# EAGLE design ESO_SENIOR_DESIGN (EAGLE 9.1.3)

## Sheet 1 of 2
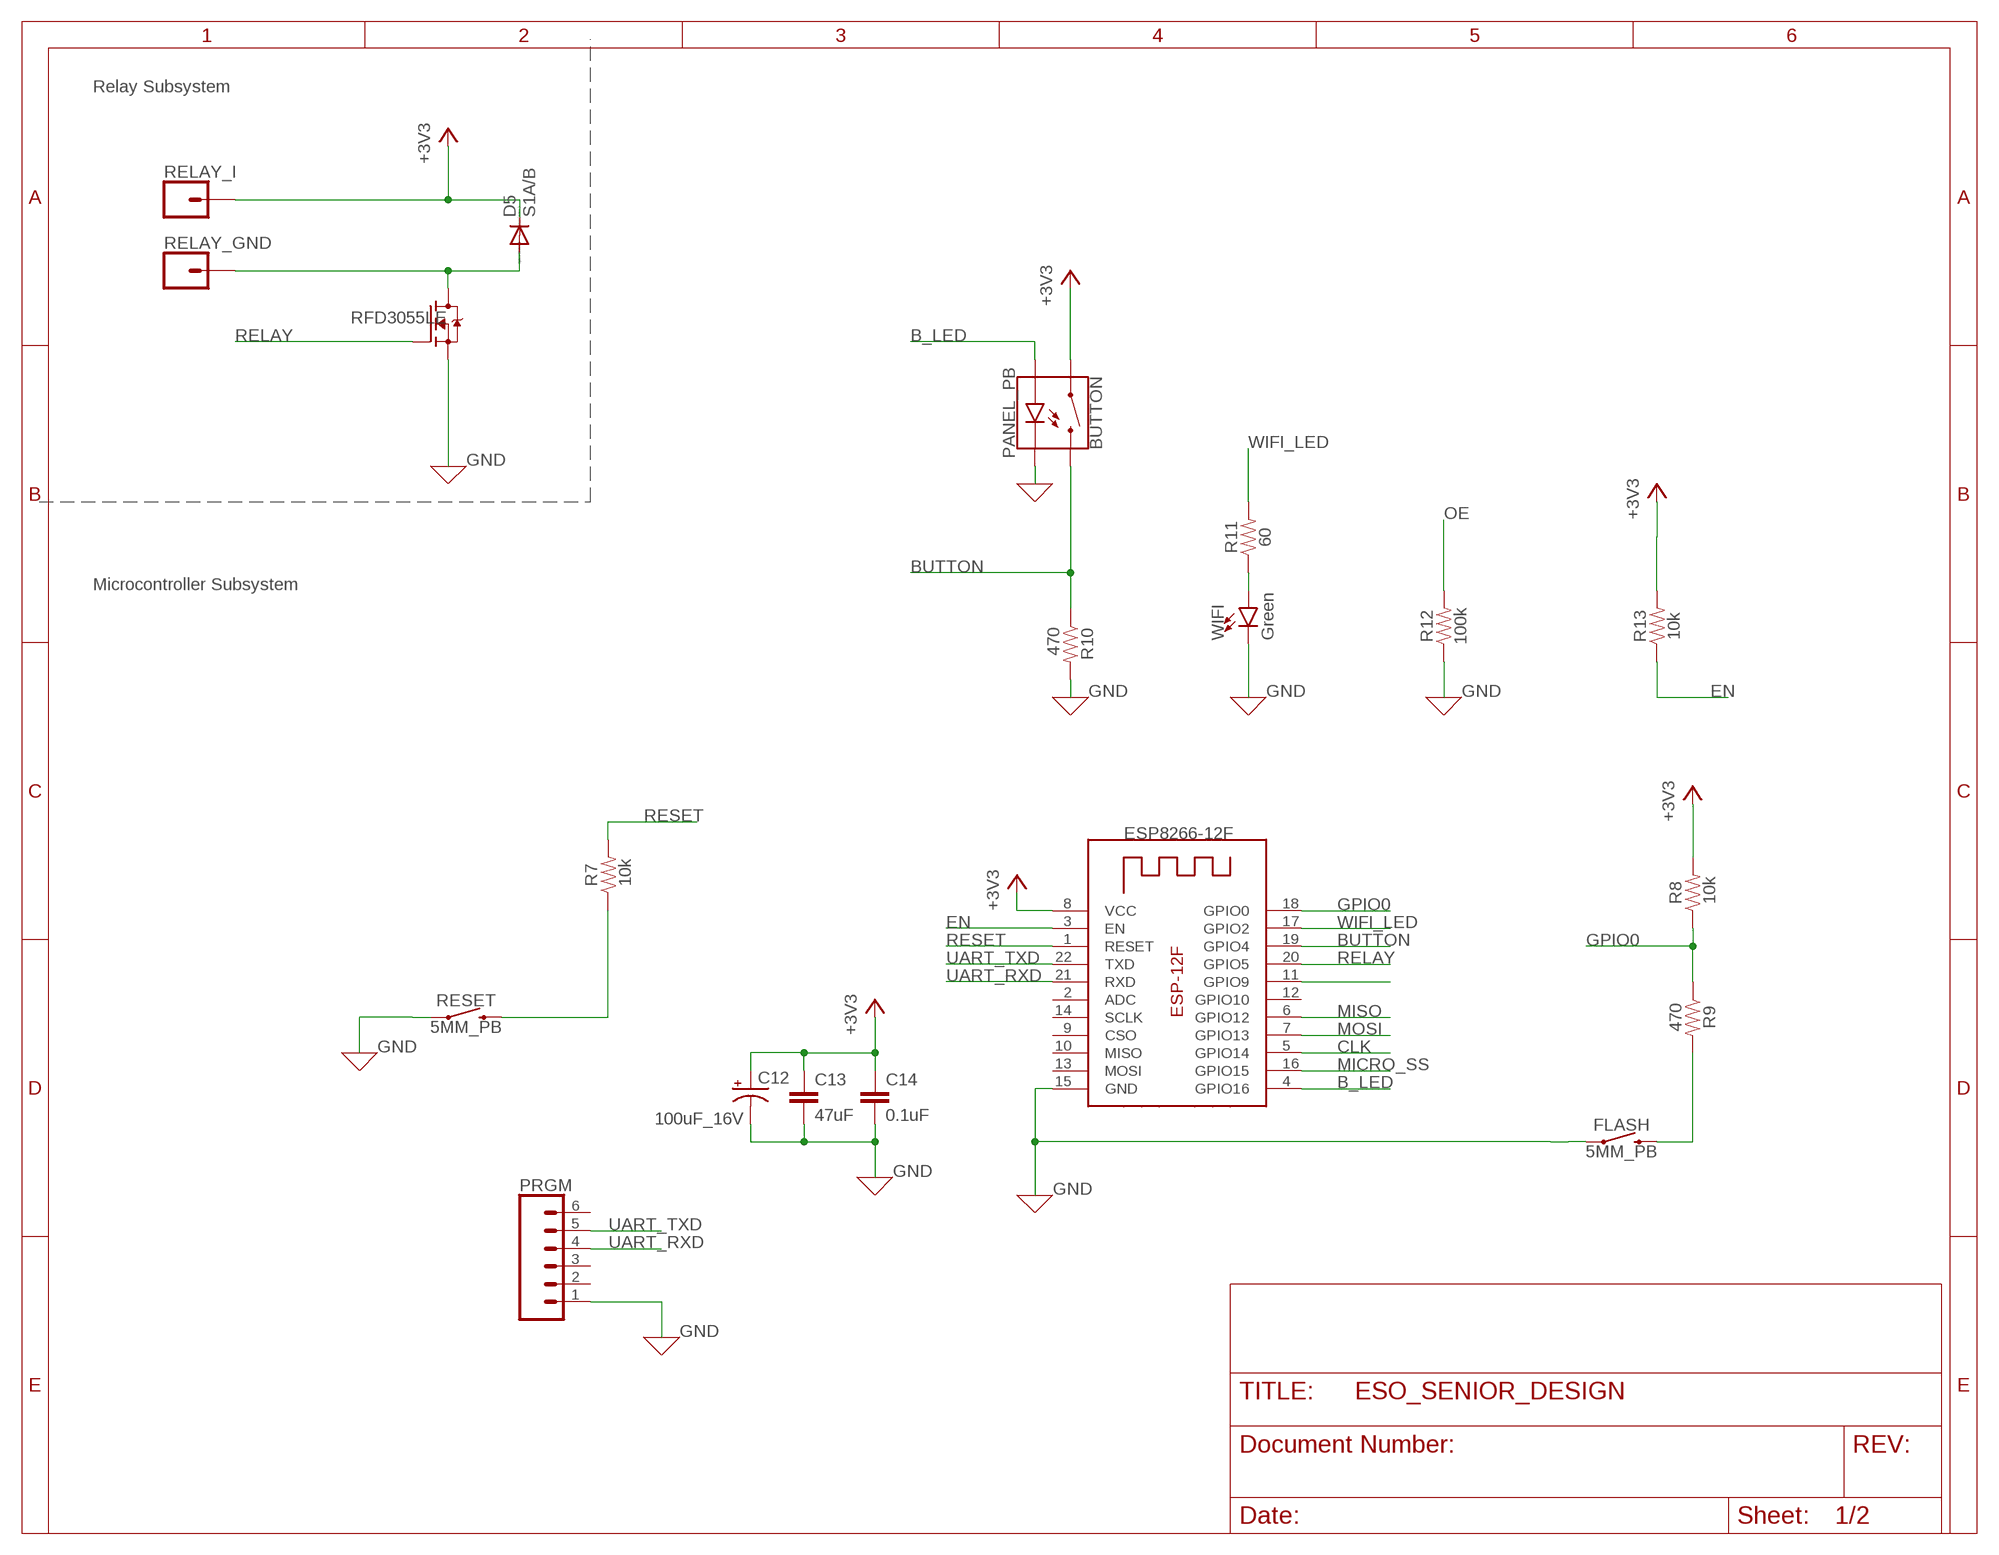
[diagram p0: schematic, sheet 1, part 1 of 2]
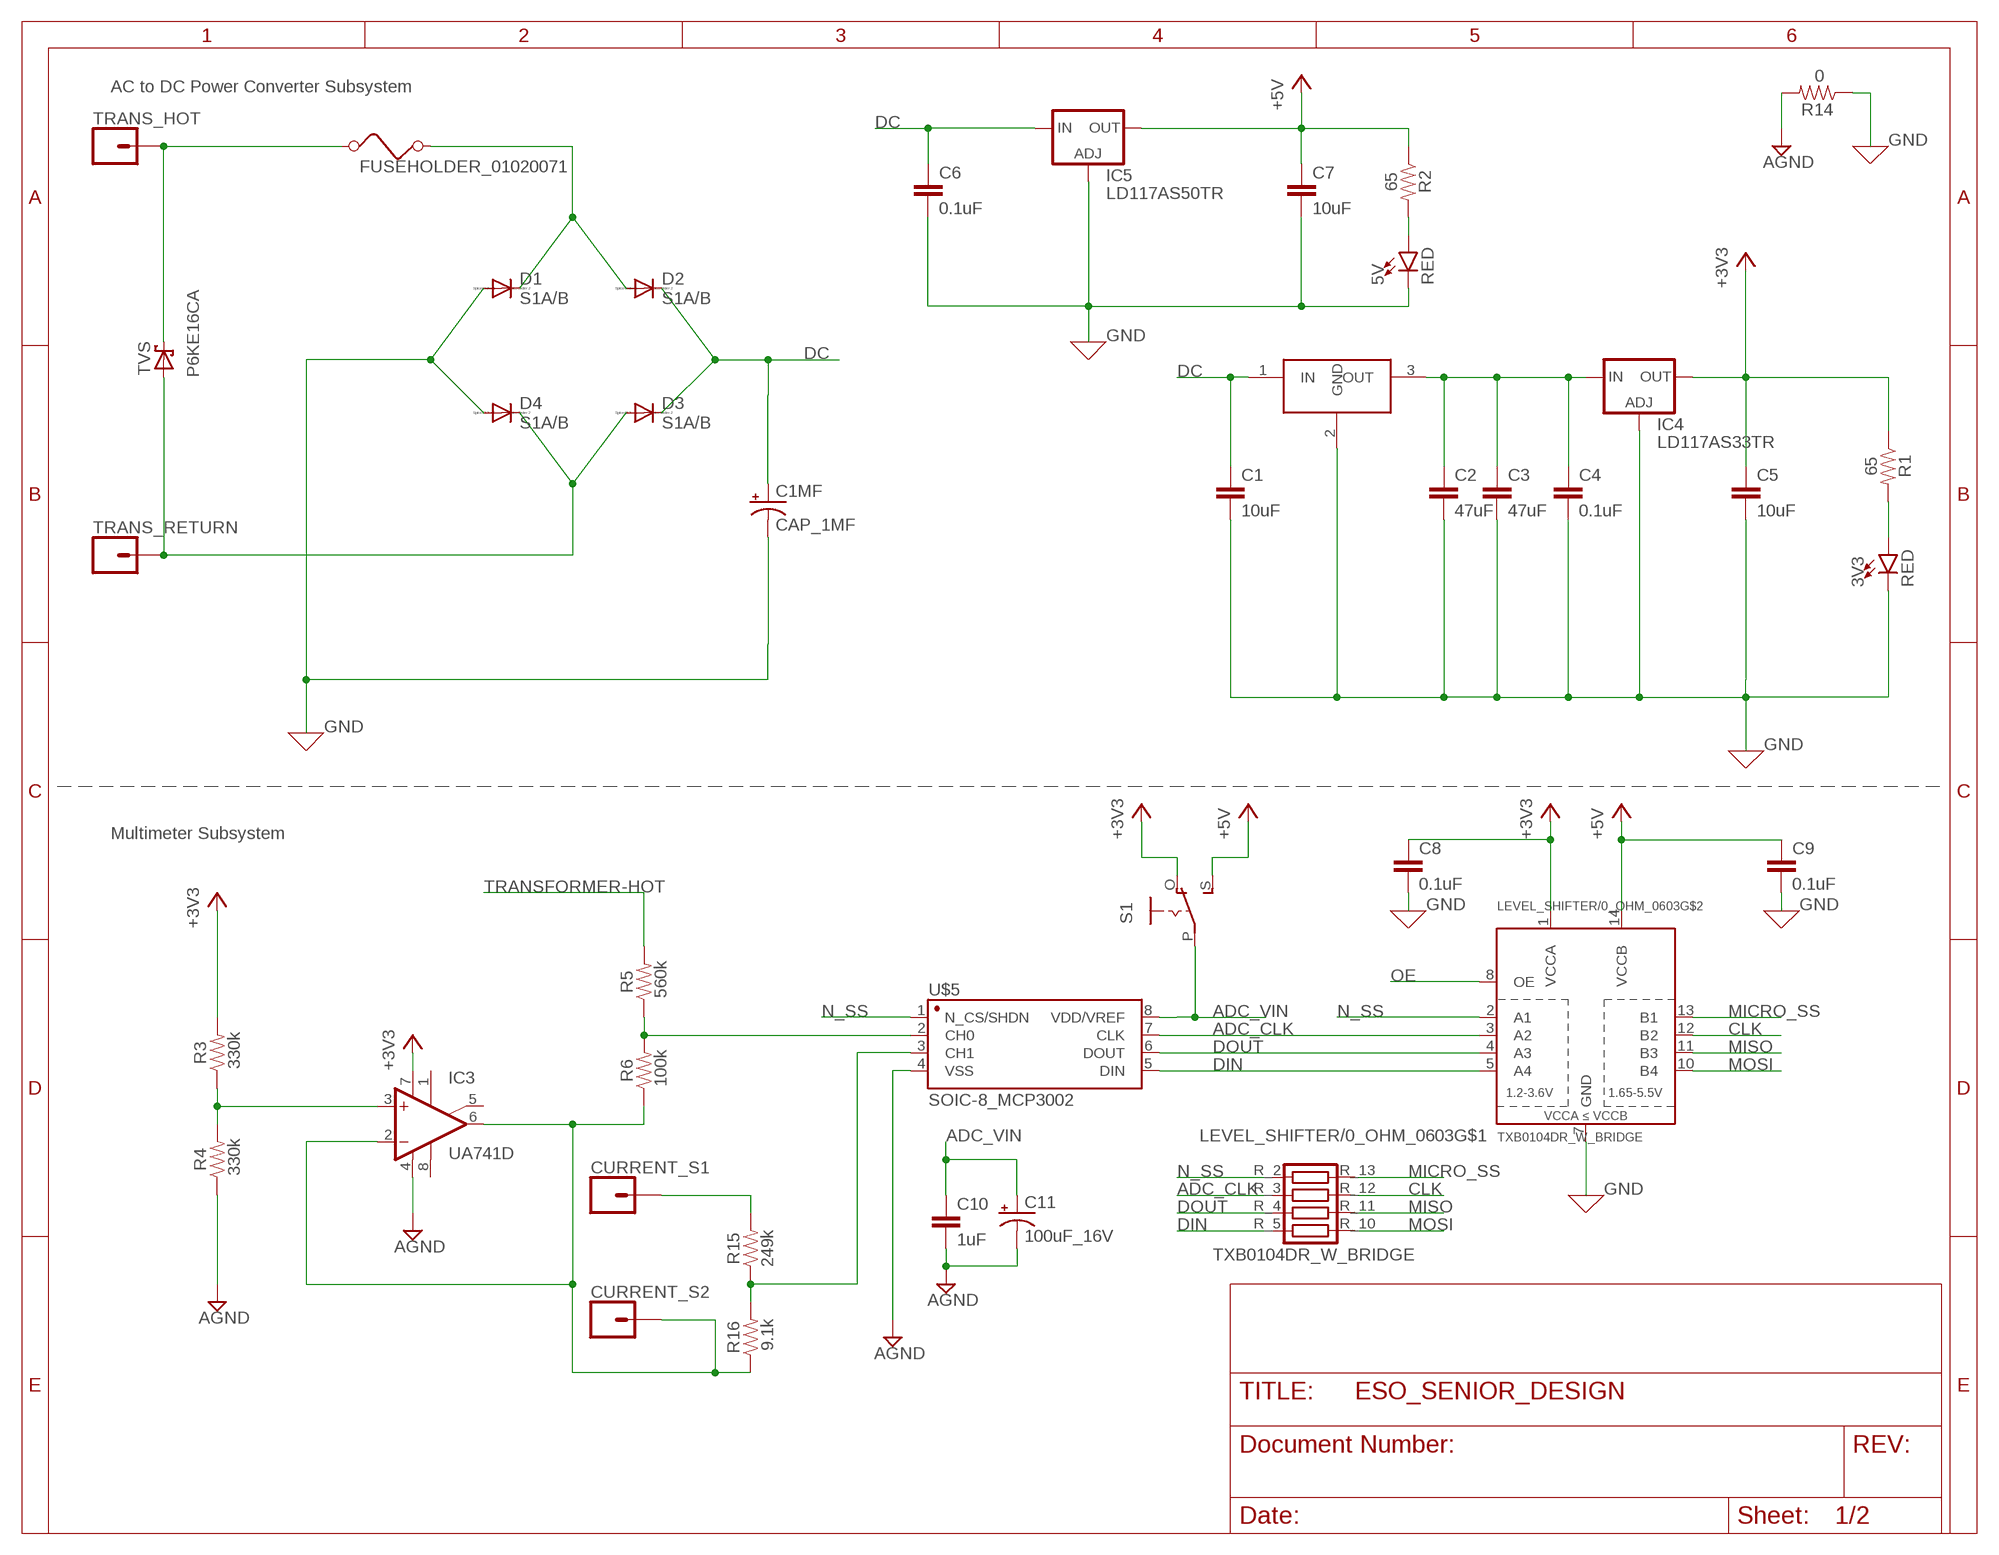
[diagram p1: schematic, sheet 1, part 2 of 2]

### Parts
3V3  RED  LED1206  [LED-1206]
5V  RED  LED1206  [LED-1206]
12F  ESP-12F  [ESP-12F]
BUTTON  PANEL_PB  [PANEL_PB]
C1  10uF  C-EUC0805  [C0805]
C1MF  CAP_1MF  [PANASONIC_H13]
C2  47uF  C-EUC0805  [C0805]
C3  47uF  C-EUC0805  [C0805]
C4  0.1uF  C-EUC0805  [C0805]
C5  10uF  C-EUC0805  [C0805]
C6  0.1uF  C-EUC0805  [C0805]
C7  10uF  C-EUC0805  [C0805]
C8  0.1uF  C-EUC0805  [C0805]
C9  0.1uF  C-EUC0805  [C0805]
C10  1uF  C-EUC0805  [C0805]
C11  100uF_16V  CPOL-USC  [PANASONIC_C]
C12  100uF_16V  CPOL-USC  [PANASONIC_C]
C13  47uF  C-EUC0805  [C0805]
C14  0.1uF  C-EUC0805  [C0805]
CURRENT_S1  CONN_01  [1X01]
CURRENT_S2  CONN_01  [1X01]
D1  S1A/B  DIODE-SMB  [SMB]
D2  S1A/B  DIODE-SMB  [SMB]
D3  S1A/B  DIODE-SMB  [SMB]
D4  S1A/B  DIODE-SMB  [SMB]
D5  S1A/B  DIODE-SMB  [SMB]
FLASH  5MM_PB  [TACTILE_SWITCH_SMD_5MM]
IC3  UA741D  [SO08]
IC4  LD117AS33TR  [SOT223]
IC5  LD117AS50TR  [SOT223]
LEVEL_SHIFTER/0_OHM_0603  TXB0104DR_W_BRIDGE  [SO14]
PRGM  CONN_06NO_SILK_FEMALE_PTH  [1X06_NO_SILK]
Q$1  RFD3055LE  [TO92-SGD]
R1  65  RESISTOR0805  [0805]
R2  65  RESISTOR0805  [0805]
R3  330k  RESISTOR0805  [0805]
R4  330k  RESISTOR0805  [0805]
R5  560k  RESISTOR0805  [0805]
R6  100k  RESISTOR0805  [0805]
R7  10k  RESISTOR0805  [0805]
R8  10k  RESISTOR0805  [0805]
R9  470  RESISTOR0805  [0805]
R10  470  RESISTOR0805  [0805]
R11  60  RESISTOR0805  [0805]
R12  100k  RESISTOR0805  [0805]
R13  10k  RESISTOR0805  [0805]
R14  0  RESISTOR0805  [0805]
R15  249k  RESISTOR0805  [0805]
R16  9.1k  RESISTOR0805  [0805]
RELAY_GND  CONN_01  [1X01]
RELAY_I  CONN_01  [1X01]
RESET  5MM_PB  [TACTILE_SWITCH_SMD_5MM]
S1  EG1218S  [EG1218]
TRANS_HOT  CONN_01  [1X01]
TRANS_RETURN  CONN_01  [1X01]
TVS  1N5819-T  [DO41-7.6]
U$1  FUSEHOLDER_01020071  [FUSEHOLDER_01020071Z]
U$3  BUCK  [TO220H]
U$5  SOIC-8_MCP3002  [SO08-0.15]
WIFI  Green  LED1206  [LED-1206]

### Nets
+3V3: 12F.8(VCC) BUTTON.1 C5.1 C8.1 C12.+ C13.1 C14.1 D5.C IC3.7(V+) IC4.2(OUT) IC4.4(OUT) LEVEL_SHIFTER/0_OHM_0603.1(VCCA) R1.1 R3.2 R8.2 R13.2 RELAY_I.1 S1.O
+5V: C7.1 C9.1 IC5.2(OUT) IC5.4(OUT) LEVEL_SHIFTER/0_OHM_0603.14(VCCB) R2.1 S1.S
ADC_CLK: LEVEL_SHIFTER/0_OHM_0603.3(A2) LEVEL_SHIFTER/0_OHM_0603.R_3 U$5.7(CLK)
ADC_VIN: C10.1 C11.+ S1.P U$5.8(VDD/VREF)
AGND: C10.2 C11.- IC3.4(V-) R4.1 R14.2 U$5.4(VSS)
B_LED: 12F.4(GPIO16) BUTTON.3(A)
BUTTON: 12F.19(GPIO4) BUTTON.2 R10.1
C2: C2.1 C3.1 C4.1 IC4.3(IN) U$3.3(OUT)
CLK: 12F.5(GPIO14) LEVEL_SHIFTER/0_OHM_0603.12(B2) LEVEL_SHIFTER/0_OHM_0603.R_12
DC: C1.1 C1MF.+ C6.1 D2.C D3.C IC5.3(IN) U$3.1(IN)
DIN: LEVEL_SHIFTER/0_OHM_0603.5(A4) LEVEL_SHIFTER/0_OHM_0603.R_5 U$5.5(DIN)
DOUT: LEVEL_SHIFTER/0_OHM_0603.4(A3) LEVEL_SHIFTER/0_OHM_0603.R_4 U$5.6(DOUT)
EN: 12F.3(EN) R13.1
GND: 3V3.C 5V.C 12F.15(GND) BUTTON.4(C) C1.2 C1MF.- C2.2 C3.2 C4.2 C5.2 C6.2 C7.2 C8.2 C9.2 C12.- C13.2 C14.2 D1.A D4.A FLASH.1 FLASH.3 IC4.1(ADJ) IC5.1(ADJ) LEVEL_SHIFTER/0_OHM_0603.7(GND) PRGM.1 Q$1.S R10.2 R12.1 R14.1 RESET.1 RESET.3 U$3.2(GND) WIFI.C
GPIO0: 12F.18(GPIO0) R8.1 R9.1
MICRO_SS: 12F.16(GPIO15) LEVEL_SHIFTER/0_OHM_0603.13(B1) LEVEL_SHIFTER/0_OHM_0603.R_13
MISO: 12F.6(GPIO12) LEVEL_SHIFTER/0_OHM_0603.11(B3) LEVEL_SHIFTER/0_OHM_0603.R_11
MOSI: 12F.7(GPIO13) LEVEL_SHIFTER/0_OHM_0603.10(B4) LEVEL_SHIFTER/0_OHM_0603.R_10
N$1: R7.1 RESET.2 RESET.4
N$2: D1.C D2.A U$1.P$3
N$3: 3V3.A R1.2
N$4: IC3.3(+IN) R3.1 R4.2
N$5: R15.1 R16.2 U$5.3(CH1)
N$6: R5.1 R6.2 U$5.2(CH0)
N$7: 5V.A R2.2
N$8: CURRENT_S2.1 IC3.2(-IN) IC3.6(OUT) R6.1 R16.1
N$10: FLASH.2 FLASH.4 R9.2
N$11: R11.1 WIFI.A
N$14: D5.A Q$1.D RELAY_GND.1
N$16: CURRENT_S1.1 R15.2
N_SS: LEVEL_SHIFTER/0_OHM_0603.2(A1) LEVEL_SHIFTER/0_OHM_0603.R_2 U$5.1(N_CS/SHDN)
OE: 12F.11(GPIO9) LEVEL_SHIFTER/0_OHM_0603.8(OE) R12.2
RELAY: 12F.20(GPIO5) Q$1.G
RESET: 12F.1(RESET) R7.2
TRANSFORMER-HOT: R5.2 TRANS_HOT.1 TVS.C U$1.P$1
TRANSFORMER-RETURN: D3.A D4.C TRANS_RETURN.1 TVS.A
UART_RXD: 12F.21(RXD) PRGM.4
UART_TXD: 12F.22(TXD) PRGM.5
WIFI_LED: 12F.17(GPIO2) R11.2
Unconnected: 12F.2(ADC) 12F.9(CSO) 12F.10(MISO) 12F.12(GPIO10) 12F.13(MOSI) 12F.14(SCLK) IC3.1(ON1) IC3.5(ON2) IC3.8(OPT) PRGM.2 PRGM.3 PRGM.6

### Notes on the sheet
- Relay Subsystem | AC to DC Power Converter Subsystem
- P6KE16CA
- Microcontroller Subsystem
- ESP8266-12F | Multimeter Subsystem

## Sheet 2 of 2

## Library data of the parts
3V3 5V WIFI = SparkFun-LED:LED: LED (Generic) Standard schematic elements and footprints for 5mm, 3mm, 1206, and 0603 sized LEDs. Generic LEDs with no color specified.
12F = Mykaela_lib:ESP-12F
BUTTON = Mykaela_lib:PANEL_PB
C1-C10 C13 C14 = rcl:C-EU: CAPACITOR, European symbol; SPICEPREFIX: C
C1MF = Mykaela_lib:CAP_1MF
C11 C12 = adafruit:CPOL-US: POLARIZED CAPACITOR, American symbol
CURRENT_S1 CURRENT_S2 RELAY_GND RELAY_I TRANS_HOT TRANS_RETURN = SparkFun-Connectors:CONN_01: Single connection point. Often used as Generic Header-pin footprint for 0.1 inch spaced/style header connections On any of the 0.1 inch spaced packages, you can populate with these: Break Away Headers - Straight <https://www.sparkfun.com/products/116> (PRT-00116) Break Away Male Headers - Right Angle <https://www.sparkfun.com/products/553> (PRT-00553) Female Headers <https://www.sparkfun.com/products/115> (PRT-00115) Break Away Headers - Machine Pin <https://www.sparkfun.com/products/117> (PRT-00117) Break Away Female Headers - Swiss Machine Pin <https://www.sparkfun.com/products/743> (PRT-00743) This device is also useful as a general connection point to wire up your design to another part of your project. Our various solder wires solder well into these plated through hole pads. Hook-Up Wire - Assortment (Stranded, 22 AWG) <https://www.sparkfun.com/products/11375> (PRT-11375) Hook-Up Wire - Assortment (Solid Core, 22 AWG) <https://www.sparkfun.com/products/11367> (PRT-11367) View the entire wire category on our website here <https://www.sparkfun.com/categories/141> Special notes: SMTSO-256-ET is a "flush mount" nut for a 4-40 screw. We mostly use this on specialty testbeds; it is a nice way to connect hardware to your PCB at an adjustable hieght. Also note, the SNAP packages are for using a snappable style connector. We sell a baggie of snaps and they are also used on two LilyPad designs: Snap Assortment - 30 pack (male and female) <https://www.sparkfun.com/products/11347> (DEV-11347) LilyPad Arduino SimpleSnap <https://www.sparkfun.com/products/10941> (DEV-10941) LilyPad SimpleSnap Protoboard <https://www.sparkfun.com/products/10940> (DEV-10940)
D1-D5 = diode:DIODE-: DIODE
FLASH RESET = Mykaela_lib:5MM_PB
IC3 = linear:*741: OP AMP
IC4 IC5 = Mykaela_lib:LD117A?*: Low drop fixed and adjustable positive voltage regulators 1 A Source: http://www.st.com/stonline/products/literature/ds/7194/ld1117axx.pdf
LEVEL_SHIFTER/0_OHM_0603 = Mykaela_lib:TXB0104DR_W_BRIDGE
PRGM = SparkFun-Connectors:CONN_06: Multi connection point. Often used as Generic Header-pin footprint for 0.1 inch spaced/style header connections On any of the 0.1 inch spaced packages, you can populate with these: Break Away Headers - Straight <https://www.sparkfun.com/products/116> (PRT-00116) Break Away Male Headers - Right Angle <https://www.sparkfun.com/products/553> (PRT-00553) Female Headers <https://www.sparkfun.com/products/115> (PRT-00115) Break Away Headers - Machine Pin <https://www.sparkfun.com/products/117> (PRT-00117) Break Away Female Headers - Swiss Machine Pin <https://www.sparkfun.com/products/743> (PRT-00743) Arduino Stackable Header - 6 Pin <https://www.sparkfun.com/products/9280> (PRT-09280) For SCREWTERMINALS and SPRING TERMINALS visit here: Screw Terimnals on SparkFun.com <https://www.sparkfun.com/search/results?term=Screw+Terminals> (5mm/3.5mm/2.54mm spacing) This device is also useful as a general connection point to wire up your design to another part of your project. Our various solder wires solder well into these plated through hole pads. Hook-Up Wire - Assortment (Stranded, 22 AWG) <https://www.sparkfun.com/products/11375> (PRT-11375) Hook-Up Wire - Assortment (Solid Core, 22 AWG) <https://www.sparkfun.com/products/11367> (PRT-11367) View the entire wire category on our website here <https://www.sparkfun.com/categories/141>; PROD_ID: CONN-08437
Q$1 = Mykaela_lib:RFD3055LE
R1-R16 = SparkFun-Resistors:RESISTOR: Generic Resistor Package
S1 = adafruit:EG1218: SLIDING SWITCH 0.1" spacing through hole, vertical SPDT slide switch http://www.ladyada.net/library/pcb/eaglelibrary.html
TVS = diode:1N581*: 1.0A SCHOTTKY BARRIER RECTIFIER Source: http://www.diodes.com/datasheets/ds23001.pdf
U$1 = Mykaela_lib:FUSEHOLDER_01020071
U$3 = Mykaela_lib:BUCK
U$5 = Mykaela_lib:SOIC-8_MCP3002

## Board
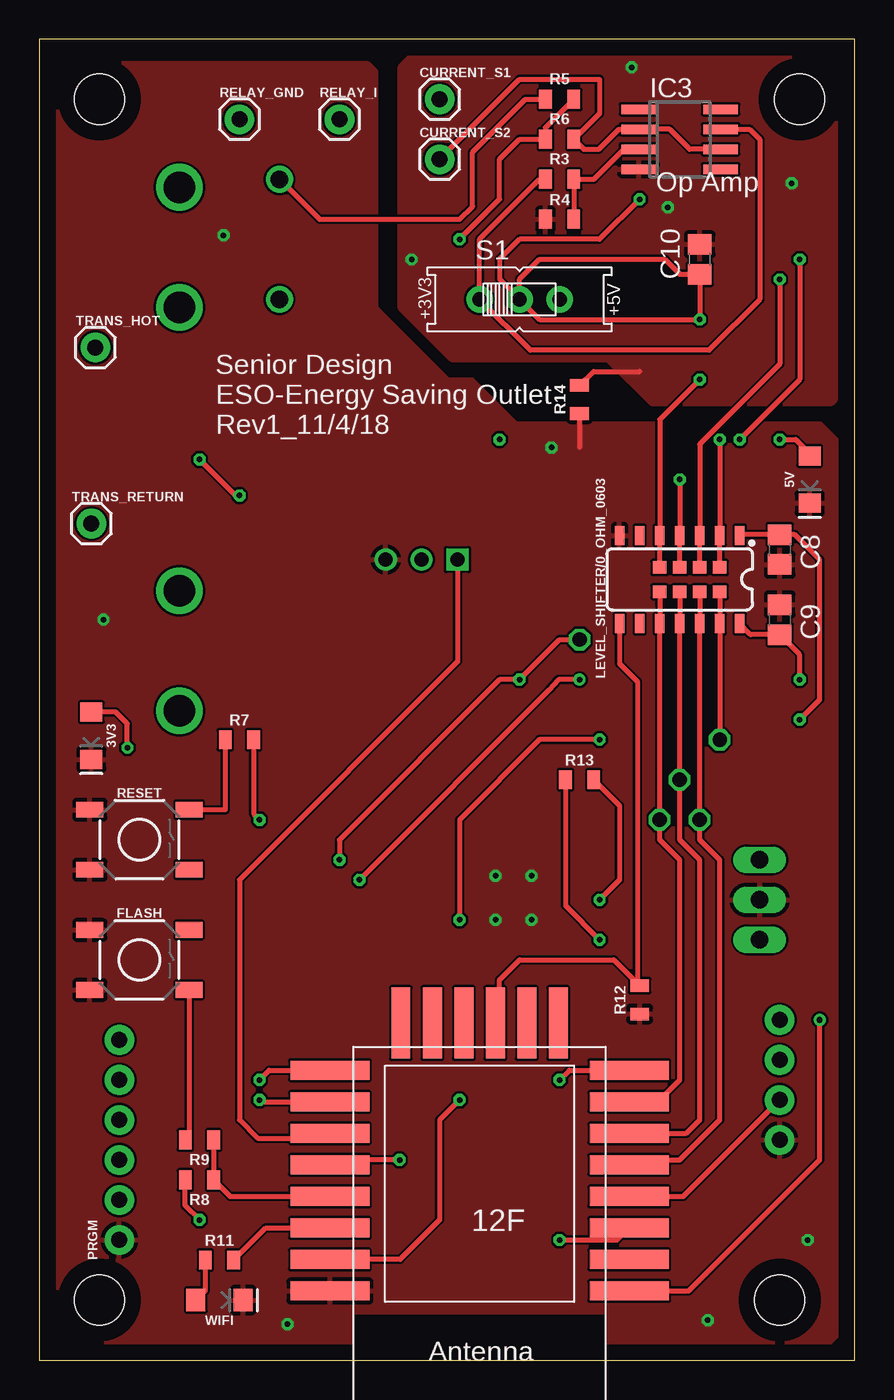
[diagram p2: board, top side]
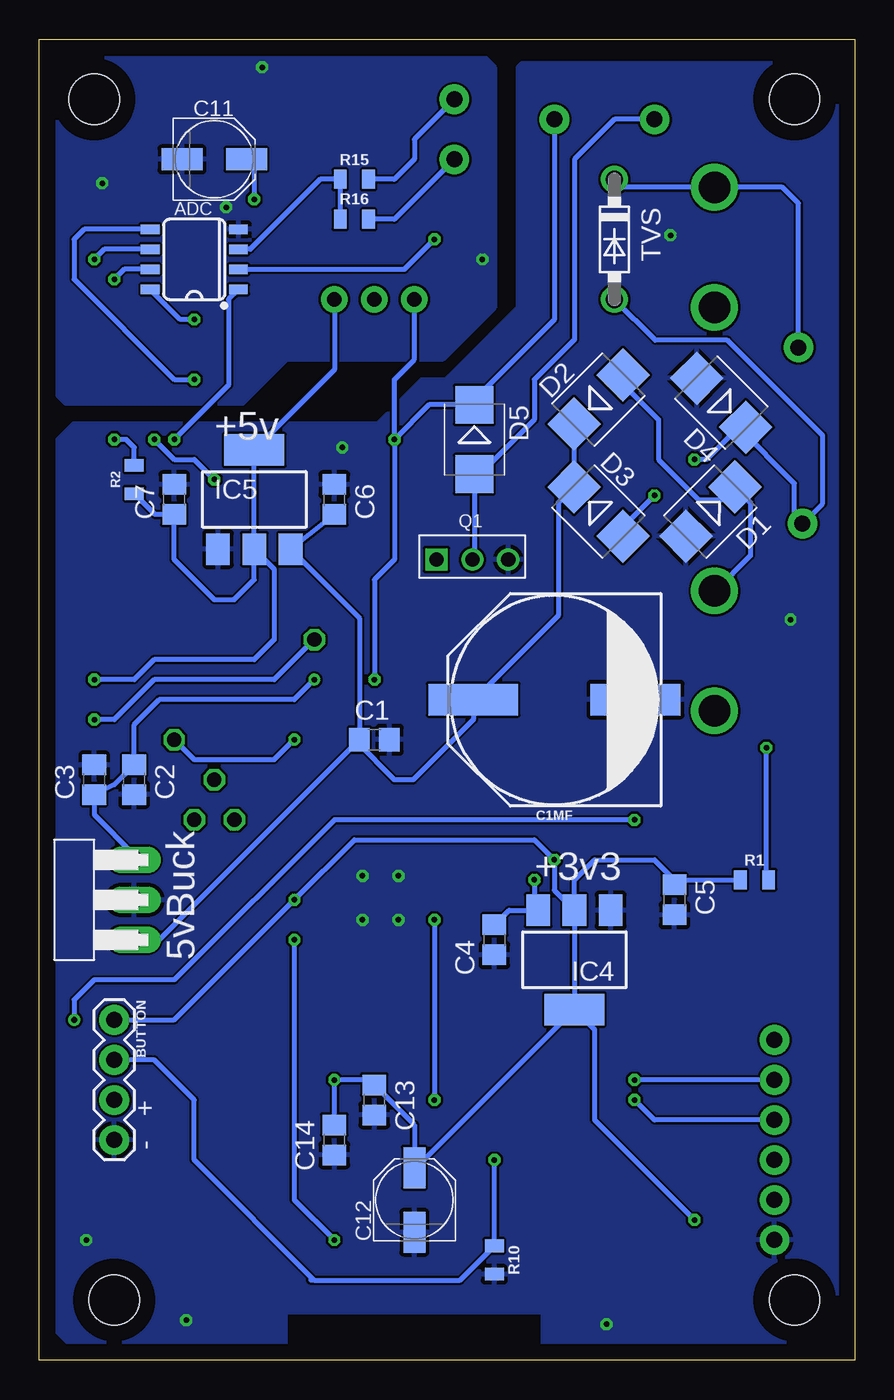
[diagram p3: board, bottom side, seen from below]

Size 51.74 x 83.81 mm. Coordinates in mm from the lower left corner, seen from the top.
Outline: 0,0 51.74,0 51.74,83.81 0,83.81 0,0
Copper layers (1*16): Top 0.035mm / dielectric 1.5mm / Bottom 0.035mm
Design rules "default": minimum track width 6mil, minimum drill 0.35mm, track to track 6mil, track to pad 6mil, pad to pad 6mil, via to via 6mil, smd to smd 6mil, copper to edge 40mil, drill to drill 6mil, minimum pad ring 10mil, minimum via ring 8mil, stop-mask expansion 4mil, vias tented up to drill 0mil, thermal gap 10mil
Holes 3.17 mm at 3.81,80.01 48.26,80.01 46.99,3.81 3.81,3.81

### Footprints (pad centres in the part's own frame; a part is rotated, then mirrored left to right if it is on the bottom)
LED-1206 = smd 1.2 x 1.4: A -1.5,0; C 1.5,0
ESP-12F = smd 5 x 1.2: 1 -9.5,4.5; 2 -9.5,2.5; 3 -9.5,0.5; 4 -9.5,-1.5; 5 -9.5,-3.5; 6 -9.5,-5.5; 7 -9.5,-7.5; 8 -9.5,-9.5; 15 9.5,4.5; 16 9.5,2.5; 17 9.5,0.5; 18 9.5,-1.5; 19 9.5,-3.5; 20 9.5,-5.5; 21 9.5,-7.5; 22 9.5,-9.5 | smd 1.2 x 4.5: 9 -5,-12.5; 10 -3,-12.5; 11 -1,-12.5; 12 1,-12.5; 13 3,-12.5; 14 5,-12.5
PANEL_PB = drill 1.016 pad 1.88: 1 0,0; 2 2.54,0; 3 5.08,0; 4 7.62,0
C0805 = smd 1.3 x 1.5: 1 -0.95,0; 2 0.95,0
PANASONIC_H13 = smd 5.7 x 2: + 5.15,0; - -5.15,0
PANASONIC_C = smd 2.6 x 1.4: + 2.05,0; - -2.05,0
1X01 = drill 1.016 pad 1.88: 1 0,0
SMB = smd 2.4 x 2.4: A 2.2,0; C -2.2,0
TACTILE_SWITCH_SMD_5MM = smd 1.7 x 1: 1 -3.15,1.9; 2 3.15,1.9; 3 -3.15,-1.9; 4 3.15,-1.9
SO08 = smd 0.6 x 2.2: 1 -1.905,-2.6; 2 -0.635,-2.6; 3 0.635,-2.6; 4 1.905,-2.6; 5 1.905,2.6; 6 0.635,2.6; 7 -0.635,2.6; 8 -1.905,2.6
SOT223 = smd 1.5 x 2: 1 -2.3,-3.15; 2 0,-3.15; 3 2.3,-3.15 | smd 3.8 x 2: 4 0,3.15
SO14 = smd 0.6 x 1.2: 1 -3.81,-2.8; 2 -2.54,-2.8; 3 -1.27,-2.8; 4 0,-2.8; 5 1.27,-2.8; 6 2.54,-2.8; 7 3.81,-2.8; 8 3.81,2.8; 9 2.54,2.8; 10 1.27,2.8; 11 0,2.8; 12 -1.27,2.8; 13 -2.54,2.8; 14 -3.81,2.8 | smd 0.864 x 0.787: R_2 -2.54,-0.775; R_3 -1.27,-0.775; R_4 0,-0.775; R_5 1.27,-0.775; R_10 1.27,0.775; R_11 0,0.775; R_12 -1.27,0.775; R_13 -2.54,0.775
1X06_NO_SILK = drill 1.016 pad 1.88: 1 0,0; 2 2.54,0; 3 5.08,0; 4 7.62,0; 5 10.16,0; 6 12.7,0
TO92-SGD = drill 0.9: D -0.13,-1.27; S 2.15,-1.27 | drill 0.9 square: G -2.41,-1.27
0805 = smd 0.8 x 1.2: 1 -0.9,0; 2 0.9,0
EG1218 = drill 0.9 pad 1.676: O -2.54,0; P 0,0; S 2.54,0
DO41-7.6 = drill 1.1 pad 1.7: A 3.81,0; C -3.81,0
FUSEHOLDER_01020071Z = drill 1.98: P$1 -3.81,0; P$2 3.81,0; P$3 21.79,0; P$4 29.41,0
TO220H = drill 1.118 long: 1 -2.54,-10.16; 2 0,-10.16; 3 2.54,-10.16
SO08-0.15 = smd 0.6 x 1.2: 1 -1.905,-2.8; 2 -0.635,-2.8; 3 0.635,-2.8; 4 1.905,-2.8; 5 1.905,2.8; 6 0.635,2.8; 7 -0.635,2.8; 8 -1.905,2.8

### Placement (x,y rotation side)
3V3  3.3,39.62 270 top
5V  48.9,55.88 270 top
12F  27.94,8.89 180 top
BUTTON  46.99,21.59 270 bottom
C1  30.48,39.37 0 bottom
C1MF  19.05,41.91 180 bottom
C2  45.72,36.83 270 bottom
C3  48.26,36.83 90 bottom
C4  22.86,26.67 270 bottom
C5  11.43,29.21 270 bottom
C6  33.02,54.61 90 bottom
C7  43.18,54.61 90 bottom
C8  46.99,51.44 270 top
C9  46.99,46.99 90 top
C10  41.91,69.85 90 top
C11  40.64,76.2 0 bottom
C12  27.94,10.16 90 bottom
C13  30.48,16.51 270 bottom
C14  33.02,13.97 270 bottom
CURRENT_S1  25.4,80.01 0 top
CURRENT_S2  25.4,76.2 0 top
D1  9.14,53.85 225 bottom
D2  16.26,60.96 45 bottom
D3  16.26,53.85 315 bottom
D4  8.46,60.76 135 bottom
D5  24.13,58.42 270 bottom
FLASH  6.35,25.4 0 top
IC3  40.64,77.47 270 top
IC4  17.78,25.4 180 bottom
IC5  38.1,54.61 0 bottom
LEVEL_SHIFTER/0_OHM_0603  40.64,49.53 180 top
PRGM  5.08,7.62 90 top
Q$1  24.13,52.07 0 bottom
R1  6.35,30.48 0 bottom
R2  45.72,55.88 90 bottom
R3  33.02,74.93 180 top
R4  33.02,72.39 0 top
R5  33.02,80.01 180 top
R6  33.02,77.47 180 top
R7  12.7,39.37 0 top
R8  10.16,11.43 180 top
R9  10.16,13.97 180 top
R10  22.86,6.35 270 bottom
R11  11.43,6.35 0 top
R12  38.1,22.86 90 top
R13  34.29,36.83 0 top
R14  34.29,60.96 90 top
R15  31.75,74.93 0 bottom
R16  31.75,72.39 180 bottom
RELAY_GND  12.7,78.74 0 top
RELAY_I  19.05,78.74 0 top
RESET  6.35,33.02 0 top
S1  30.48,67.31 0 top
TRANS_HOT  3.56,64.26 0 top
TRANS_RETURN  3.3,53.09 0 top
TVS  15.24,71.12 270 bottom
U$1  8.89,70.61 270 top
U$3  55.88,29.21 90 bottom
U$5  41.91,69.85 90 bottom
WIFI  11.43,3.81 0 top

### Tracks (layer width: path | path; a pad name or v marks a point on that pad's centre or on a via)
+3V3  (via drill 0.35, 0.9)
  Top 0.305: v33.02,17.78 33.63,18.39 12F.8 | v10.16,8.89 9.26,9.79 R8.2 | v19.05,31.75 19.05,33.02 29.21,43.18 v30.48,43.18 31.75,44.45 33.02,45.72 | R13.2 36.83,35.19 36.83,30.48 v35.56,29.21 | R3.2 31.75,74.93 27.94,71.12 S1.O 31.16,64.09 42.5,64.09 45.72,67.31 45.72,77.47 45.09,78.11 IC3.7 | 33.02,45.72 v34.29,45.72 33.02,45.72 | v48.26,40.64 49.53,41.91 49.53,50.8 47.95,52.38 C8.1 44.51,52.38 LEVEL_SHIFTER/0_OHM_0603.1
  Bottom 0.305: C14.1 v33.02,17.78 30.8,17.78 C13.1 27.94,14.92 C12.+ 27.82,12.21 IC4.4 | R1.1 11.11,30.48 C5.1 11.43,30.48 12.7,31.75 16.51,31.75 17.78,30.48 IC4.2 | IC4.2 IC4.4 | v29.21,58.42 27.01,60.62 D5.C 24.13,60.96 19.05,66.04 RELAY_I.1 | v29.21,58.42 29.21,50.8 30.48,49.53 v30.48,43.18 | IC4.2 19.05,29.82 v19.05,31.75 20.32,33.02 31.75,33.02 v35.56,29.21 43.18,21.59 BUTTON.1 | v10.16,8.89 16.51,15.24 16.51,20.98 IC4.4 | v29.21,58.42 29.21,62.23 | 29.21,62.23 | S1.O 27.94,63.5 29.21,62.23 | v48.26,40.64 46.99,40.64 44.45,43.18 36.83,43.18 v34.29,45.72
+5V  (via drill 0.35)
  Top 0.305: LEVEL_SHIFTER/0_OHM_0603.14 45.14,46.04 C9.1 48.26,44.77 v48.26,43.18
  Bottom 0.305: IC5.2 38.1,49.53 39.37,48.26 40.64,48.26 43.18,50.8 C7.1 44.4,53.66 R2.1 | IC5.2 IC5.4 33.02,62.84 S1.S | IC5.2 36.83,50.19 36.83,49.53 36.83,45.72 38.1,44.45 44.45,44.45 45.72,43.18 v48.26,43.18
ADC_CLK  (via drill 0.35)
  Top 0.305: LEVEL_SHIFTER/0_OHM_0603.R_3 LEVEL_SHIFTER/0_OHM_0603.3 41.91,58.12 46.99,63.2 v46.99,68.58
  Bottom 0.305: U$5.7 46.35,69.22 v46.99,68.58
ADC_VIN  (via drill 0.35)
  Top 0.305: S1.P 30.48,68.58 31.75,69.85 39.69,69.85 40.64,68.9 C10.1 v41.91,66.04 31.75,66.04 S1.P | v38.1,73.66 35.56,71.12 30.48,71.12 29.21,69.85 29.21,68.58 S1.P
  Bottom 0.305: v41.91,66.04 42.8,66.04 U$5.8 | C11.+ 38.1,75.71 v38.1,73.66
AGND  (via drill 0.35)
  Top 0.305: R14.2 35.17,62.74 38.1,62.74
  other vias: 39.88,73.15 47.75,74.68 37.59,82.04 23.62,69.85
  pour Top: 23.11,66.55 26.16,63.5 36.07,63.5 38.86,60.71 50.29,60.71 50.55,60.96 50.55,82.3 50.04,82.8 23.62,82.8 22.86,82.04 22.86,66.8
  pour Bottom: 22.86,82.04 22.86,66.8 23.11,66.55 26.16,63.5 36.07,63.5 38.86,60.71 49.78,60.71 50.04,60.71 50.55,61.21 50.55,82.3 50.04,82.8 23.62,82.8
B_LED
  Top 0.305: 12F.4 40.87,10.39 BUTTON.3
BUTTON  (via drill 0.35)
  Top 0.305: 12F.19 18.13,12.7 v22.86,12.7
  Bottom 0.305: v22.86,12.7 R10.1 25.03,5.08 34.29,5.08 | 34.29,5.08 34.52,5.08 | 34.29,5.08 41.91,12.7 41.91,16.51 44.45,19.05 BUTTON.2
C2  (via drill 0.35)
  Top 0.305: v20.32,30.48 32.35,42.51 32.95,43.18 v34.29,43.18
  Bottom 0.305: C4.1 21.93,28.55 20.32,28.55 | 20.32,28.55 IC4.3 | v20.32,30.48 20.32,28.55 | v34.29,43.18 35.56,41.91 44.13,41.91 45.72,40.32 C2.1 46.98,36.52 C3.1 48.26,34.61 45.72,32.07 U$3.3
CLK  (via drill 0.9)
  Top 0.305: 12F.5 37.75,12.7 40.64,12.7 43.18,15.24 43.18,31.75 41.91,33.02 v41.91,34.29 LEVEL_SHIFTER/0_OHM_0603.12 LEVEL_SHIFTER/0_OHM_0603.R_12
DC
  Bottom 0.305: C6.1 IC5.3 31.43,47.09 C1.1 31.59,39.21 | D2.C D3.C 18.8,54.42 18.8,47.24 24.13,41.91 C1MF.+ 24.2,40.64 28.01,36.83 29.21,36.83 31.59,39.21 | U$3.1 44.13,26.67 31.59,39.21
DIN  (via drill 0.35)
  Top 0.305: LEVEL_SHIFTER/0_OHM_0603.R_5 39.37,52.07 | 39.37,52.07 LEVEL_SHIFTER/0_OHM_0603.5 | v41.91,62.23 39.37,59.69 39.37,52.07
  Bottom 0.305: U$5.5 48.9,71.75 49.53,71.12 49.53,68.58 43.18,62.23 v41.91,62.23
DOUT  (via drill 0.35)
  Top 0.305: LEVEL_SHIFTER/0_OHM_0603.R_4 40.64,52.07 | 40.64,52.07 LEVEL_SHIFTER/0_OHM_0603.4 | v40.64,55.88 40.64,52.07 | v48.26,69.85 48.26,62.23 v44.45,58.42
  Bottom 0.305: U$5.6 47.62,70.48 v48.26,69.85 | v40.64,55.88 41.91,57.15 43.18,57.15 v44.45,58.42
EN  (via drill 0.35)
  Top 0.305: R13.1 33.39,28.84 v35.56,26.67 | v33.02,7.62 36.67,7.62 12F.3
  Bottom 0.305: v35.56,26.67 35.56,10.16 v33.02,7.62
GND  (via drill 0.35)
  Top 0.305: R14.1 34.29,57.91
  other vias: 15.75,2.29 48.77,7.62 42.42,2.54 28.96,27.94 31.24,27.94 28.96,30.73 31.24,30.73 4.06,46.99 11.68,71.37 32.51,57.91
  pour Bottom: 1.78,1.02 49.78,1.02 50.8,2.03 50.8,58.17 49.53,59.44 49.02,59.44 30.23,59.44 29.97,59.69 27.43,62.23 25.91,62.23 21.34,66.8 21.34,70.1 21.34,82.04 21.08,82.3 2.54,82.3 0.76,80.52 0.76,79.5 0.76,2.03
  pour Top: 0.76,80.52 2.54,82.3 2.79,82.3 20.83,82.3 21.34,81.79 21.34,66.8 25.91,62.23 26.16,62.23 27.18,62.23 27.43,62.23 30.23,59.44 49.53,59.44 50.8,58.17 50.8,57.91 50.8,1.78 49.78,0.76 49.53,0.76 2.03,0.76 0.76,2.03
GPIO0
  Top 0.305: 18.21,10.16 12F.18 12.1,10.39 R8.1 R9.1
MICRO_SS  (via drill 0.35, 0.9)
  Top 0.305: LEVEL_SHIFTER/0_OHM_0603.R_13 LEVEL_SHIFTER/0_OHM_0603.13 v43.18,39.37 | v35.56,39.37 31.75,39.37 26.67,34.29 v26.67,27.94 | v26.67,16.51 25.4,15.24 25.4,8.89 22.9,6.39 12F.16
  Bottom 0.305: v43.18,39.37 41.91,38.1 36.83,38.1 v35.56,39.37 | v26.67,27.94 v26.67,16.51
MISO  (via drill 0.9)
  Top 0.305: 12F.6 41.06,14.39 41.91,15.24 41.91,31.75 40.64,33.02 v40.64,36.83 LEVEL_SHIFTER/0_OHM_0603.11 LEVEL_SHIFTER/0_OHM_0603.R_11
MOSI  (via drill 0.9)
  Top 0.305: 37.56,16.51 12F.7 39.25,16.39 40.64,17.78 40.64,31.75 39.37,33.02 v39.37,34.29 39.37,45.72 | LEVEL_SHIFTER/0_OHM_0603.R_10 LEVEL_SHIFTER/0_OHM_0603.10 39.37,45.72 | 39.37,45.4 39.37,45.72
N$1
  Top 0.305: R7.1 11.8,34.92 RESET.2
N$2
  Bottom 0.305: D2.A 14.7,61.94 12.45,59.69 12.45,57.15 9.91,54.61 8.38,54.61 D1.C 6.6,54.42 6.6,51.05 8.88,48.78 U$1.P$3
N$3  (via drill 0.35)
  Top 0.305: 3V3.A 4.85,41.12 5.59,40.39 v5.59,38.86
  Bottom 0.305: R1.2 5.59,30.62 v5.59,38.86
N$4
  Top 0.305: R4.2 R3.1 35.19,74.93 37.09,76.83 IC3.3
N$5
  Bottom 0.305: U$5.3 38.37,70.48 33.92,74.93 R15.1 R16.2
N$6  (via drill 0.35)
  Top 0.305: R5.1 32.12,78.21 R6.2 30.48,77.47 29.21,76.2 29.21,73.66 v26.67,71.12
  Bottom 0.305: U$5.2 28.57,69.22 v26.67,71.12
N$7  (via drill 0.35)
  Top 0.305: 5V.A 48.9,57.53 48.01,58.42 v46.99,58.42
  Bottom 0.305: R2.2 45.72,57.91 46.23,58.42 v46.99,58.42
N$8
  Top 0.305: IC3.6 41.27,76.83 40.01,78.11 IC3.2 36.77,78.11 35.5,76.83 34.55,76.83 R6.1 35.56,79.11 35.56,81.28 30.48,81.28 CURRENT_S2.1
  Bottom 0.305: R16.1 29.21,72.39 CURRENT_S2.1 26.67,74.93
N$10
  Top 0.305: FLASH.4 9.5,14.21 R9.2
N$11
  Top 0.305: R11.1 10.53,4.41 WIFI.A
N$14
  Bottom 0.305: Q$1.D 24.13,50.93 D5.A 23.79,56.22 20.32,59.69 20.32,62.23 17.78,64.77 17.78,76.2 15.24,78.74 RELAY_GND.1
N$16
  Bottom 0.305: CURRENT_S1.1 27.94,77.47 27.94,76.2 29.21,74.93 R15.2
N_SS  (via drill 0.35)
  Top 0.305: LEVEL_SHIFTER/0_OHM_0603.R_2 LEVEL_SHIFTER/0_OHM_0603.2 v43.18,58.42
  Bottom 0.305: v43.18,58.42 39.74,61.86 39.74,67.31 U$5.1
OE
  Top 0.305: LEVEL_SHIFTER/0_OHM_0603.8 36.83,44.19 37.97,43.05 37.97,23.89 38.03,23.83 R12.2 36.46,25.4 30.48,25.4 29.21,24.13 29.21,21.66 12F.11
RELAY
  Top 0.305: 12F.20 17.78,14.39 17.47,14.08 13.86,14.08 12.7,15.24 12.7,30.48 26.54,44.32 Q$1.G
RESET  (via drill 0.35)
  Top 0.305: 12F.1 41.22,4.39 49.53,12.7 v49.53,21.59 | R7.2 13.6,34.66 v13.97,34.29
  Bottom 0.305: v13.97,34.29 33.02,34.29 43.18,24.13 48.26,24.13 49.53,22.86 v49.53,21.59
TRANSFORMER-HOT
  Top 0.305: TVS.C 17.78,72.39 26.67,72.39 27.49,73.21 27.49,76.65 30.85,80.01 R5.2
  Bottom 0.305: TRANS_HOT.1 3.56,73.41 4.57,74.42 U$1.P$1 14.73,74.42 TVS.C
TRANSFORMER-RETURN  (via drill 0.35)
  Top 0.305: v10.16,57.15 12.45,54.86 v12.7,54.86
  Bottom 0.305: v12.7,54.86 14.7,52.86 D3.A | TVS.A 12.65,64.72 8.08,64.72 2.03,58.67 2.03,54.36 TRANS_RETURN.1 3.81,53.59 3.81,55.63 7.38,59.2 D4.C 7.35,59.2 9.4,57.15 v10.16,57.15
UART_RXD  (via drill 0.35)
  Top 0.305: v13.97,16.51 14.09,16.39 12F.21
  Bottom 0.305: v13.97,16.51 12.7,15.24 PRGM.4
UART_TXD  (via drill 0.35)
  Top 0.305: v13.97,17.78 14.58,18.39 12F.22
  Bottom 0.305: PRGM.5 v13.97,17.78
WIFI_LED
  Top 0.305: R11.2 14.37,8.39 12F.17

### Text on the board
tNames: Op Amp | +5V | +3V3 | Senior Design / ESO-Energy Saving Outlet / Rev1_11/4/18
bNames: ADC | +5v | Q1 | +3v3 | 5vBuck